# EAGLE design FuckIO_REV00 (EAGLE 9.6.1)
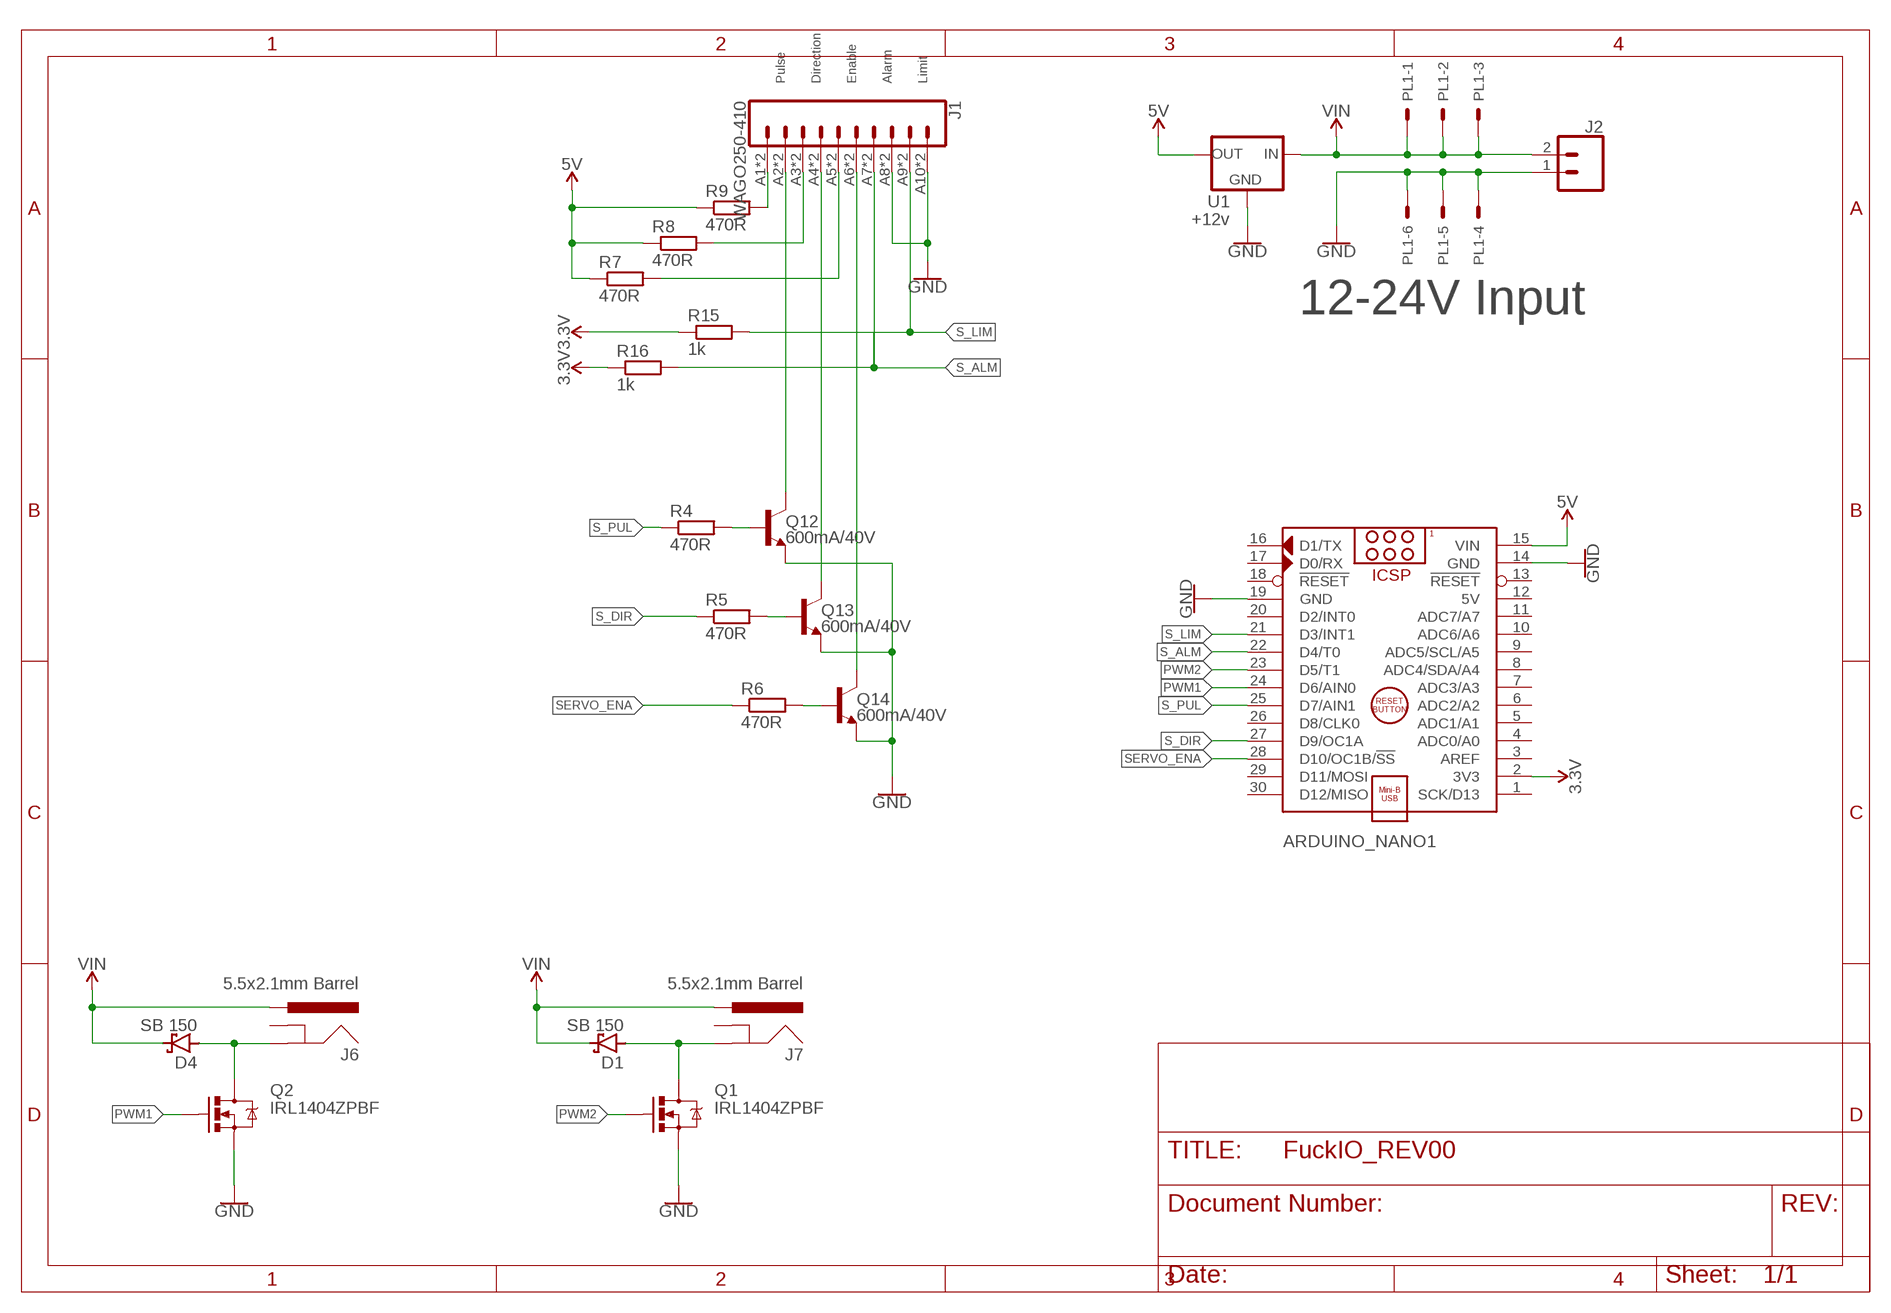
[diagram p0: schematic, sheet 1]

## Parts
ARDUINO_NANO1  ARDUINO_NANO  [ARDUINONANOV30_ARDUINO_NANO]
D1  SB 150  BAT49  [DIODE_DO41-10]
D4  SB 150  BAT49  [DIODE_DO41-10]
J1  WAGO250-410  [BEE_WAGO250-410]
J2  CONN_025MM  [SPARKFUN-CONNECTORS_SCREWTERMINAL-5MM-2]
J6  5.5x2.1mm Barrel  POWER_JACK  [SPARKFUN-CONNECTORS_POWER_JACK_PTH]
J7  5.5x2.1mm Barrel  POWER_JACK  [SPARKFUN-CONNECTORS_POWER_JACK_PTH]
PL1  CON-MOLEX-2_555X-6H  [CON-MOLEX-2_5569-6]
Q1  IRL1404ZPBF  MOSFET-NCHANNELTO220  [BEE_TO220-IGO]
Q2  IRL1404ZPBF  MOSFET-NCHANNELTO220  [BEE_TO220-IGO]
Q12  600mA/40V  TRANS_NPN-P2N2222A  [SPARKFUN-DISCRETESEMI_TO-92]
Q13  600mA/40V  TRANS_NPN-P2N2222A  [SPARKFUN-DISCRETESEMI_TO-92]
Q14  600mA/40V  TRANS_NPN-P2N2222A  [SPARKFUN-DISCRETESEMI_TO-92]
R4  470R  RCL_R-EU_0204/5  [RCL_0204/5]
R5  470R  RCL_R-EU_0204/5  [RCL_0204/5]
R6  470R  RCL_R-EU_0204/5  [RCL_0204/5]
R7  470R  RCL_R-EU_0204/5  [RCL_0204/5]
R8  470R  RCL_R-EU_0204/5  [RCL_0204/5]
R9  470R  RCL_R-EU_0204/5  [RCL_0204/5]
R15  1k  RCL_R-EU_0204/5  [RCL_0204/5]
R16  1k  RCL_R-EU_0204/5  [RCL_0204/5]
U1  +12v  V_REG_78XXSINK  [SPARKFUN-IC-POWER_TO220-IGO]

## Nets
3.3V: ARDUINO_NANO1.2(3V3) R15.1 R16.1
5V: ARDUINO_NANO1.15(VIN) R7.1 R8.1 R9.1 U1.OUT
GND: ARDUINO_NANO1.14(GND) ARDUINO_NANO1.19(GND) J1.A8 J1.A10 J1.B8 J1.B10 J2.1 PL1.4 PL1.5 PL1.6 Q1.S Q2.S Q12.3(E) Q13.3(E) Q14.3(E) U1.GND
N$2: J1.A5 J1.B5 R7.2
N$9: J1.A3 J1.B3 R8.2
N$10: J1.A1 J1.B1 R9.2
N$11: J1.A6 J1.B6 Q14.1(C)
N$12: J1.A4 J1.B4 Q13.1(C)
N$13: J1.A2 J1.B2 Q12.1(C)
N$18: Q12.2(B) R4.2
N$19: Q13.2(B) R5.2
N$20: Q14.2(B) R6.2
N$30: D4.A J6.GND Q2.D
N$35: D1.A J7.GND Q1.D
PWM1: ARDUINO_NANO1.24(D6/AIN0) Q2.G
PWM2: ARDUINO_NANO1.23(D5/T1) Q1.G
S_ALM: ARDUINO_NANO1.22(D4/T0) J1.A7 J1.B7 R16.2
S_DIR: ARDUINO_NANO1.27(D9/OC1A) R5.1
S_LIM: ARDUINO_NANO1.21(D3/INT1) J1.A9 J1.B9 R15.2
S_PUL: ARDUINO_NANO1.25(D7/AIN1) R4.1
SERVO_ENA: ARDUINO_NANO1.28(D10/OC1B/!SS) R6.1
VIN: D1.C D4.C J2.2 J6.PWR J7.PWR PL1.1 PL1.2 PL1.3 U1.IN
Unconnected: ARDUINO_NANO1.1(SCK/D13) ARDUINO_NANO1.3(AREF) ARDUINO_NANO1.4(ADC0/A0) ARDUINO_NANO1.5(ADC1/A1) ARDUINO_NANO1.6(ADC2/A2) ARDUINO_NANO1.7(ADC3/A3) ARDUINO_NANO1.8(ADC4/SDA/A4) ARDUINO_NANO1.9(ADC5/SCL/A5) ARDUINO_NANO1.10(ADC6/A6) ARDUINO_NANO1.11(ADC7/A7) ARDUINO_NANO1.13(!RESET) ARDUINO_NANO1.16(D1/TX) ARDUINO_NANO1.17(D0/RX) ARDUINO_NANO1.18(!RESET) ARDUINO_NANO1.20(D2/INT0) ARDUINO_NANO1.26(D8/CLK0) ARDUINO_NANO1.29(D11/MOSI) ARDUINO_NANO1.30(D12/MISO) J6.GNDBREAK J7.GNDBREAK

## Notes on the sheet
- Pulse | Direction | Enable | Alarm | Limit
- 12-24V Input

## Power pins joined to a net without a drawn wire
5V: ARDUINO_NANO1.12(5V)

## Library data of the parts
ARDUINO_NANO1 = FuckIO_REV00:ARDUINO_NANO: Arduino Nano V3.0 Module Overview: The Arduino Nano is a small, complete, and breadboard-friendly board based on the ATmega328 (Arduino Nano 3.x) or ATmega168 (Arduino Nano 2.x). It has more or less the same functionality of the Arduino Duemilanove, but in a different package. It lacks only a DC power jack, and works with a Mini-B USB cable instead of a standard one. The Nano was designed and is being produced by Gravitech <http://www.gravitech.us/arna30wiatp.html>. General specifications: Item Value Microcontroller Atmel ATmega168 or ATmega328 Operating Voltage (logic level) 5 V Input Voltage (recommended) 7-12 V Input Voltage (limits) 6-20 V Digital I/O Pins 14 (of which 6 provide PWM output) Analog Input Pins 8 DC Current per I/O Pin 40 mA Flash Memory 16 KB (ATmega168) or 32 KB (ATmega328) of which 2 KB used by bootloader SRAM 1 KB (ATmega168) or 2 KB (ATmega328) EEPROM 512 bytes (ATmega168) or 1 KB (ATmega328) Clock Speed 16 MHz Dimensions (Inches) 0.73" x 1.70" Dimensions (mm) 18mm x 45mm Overall height About 9 mm (not including pins) Weigth 5 g Power: The Arduino Nano can be powered via the Mini-B USB connection, 6-20V unregulated external power supply (pin 30), or 5V regulated external power supply (pin 27). The power source is automatically selected to the highest voltage source. Memory: The ATmega168 has 16 KB of flash memory for storing code (of which 2 KB is used for the bootloader); the ATmega328 has 32 KB, (also with 2 KB used for the bootloader). The ATmega168 has 1 KB of SRAM and 512 bytes of EEPROM (which can be read and written with the EEPROM library); the ATmega328 has 2 KB of SRAM and 1 KB of EEPROM. Input and Output: Each of the 14 digital pins on the Nano can be used as an input or output, using pinMode(), digitalWrite(), and digitalRead() functions. They operate at 5 volts. Each pin can provide or receive a maximum of 40 mA and has an internal pull-up resistor (disconnected by default) of 20-50 kOhms. In addition, some pins have specialized functions. Visit Arduino - ArduinoBoardNano <https://www.arduino.cc/en/Main/ArduinoBoardNano>
D1 D4 = FuckIO_REV00:BAT49: DIODE small signal diode
J1 = FuckIO_REV00:WAGO250-410
J2 = FuckIO_REV00:CONN_02: Multi connection point. Often used as Generic Header-pin footprint for 0.1 inch spaced/style header connections On any of the 0.1 inch spaced packages, you can populate with these: Break Away Headers - Straight <https://www.sparkfun.com/products/116> (PRT-00116) Break Away Male Headers - Right Angle <https://www.sparkfun.com/products/553> (PRT-00553) Female Headers <https://www.sparkfun.com/products/115> (PRT-00115) Break Away Headers - Machine Pin <https://www.sparkfun.com/products/117> (PRT-00117) Break Away Female Headers - Swiss Machine Pin <https://www.sparkfun.com/products/743> (PRT-00743) For SCREWTERMINALS and SPRING TERMINALS visit here: Screw Terimnals on SparkFun.com <https://www.sparkfun.com/search/results?term=Screw+Terminals> (5mm/3.5mm/2.54mm spacing) This device is also useful as a general connection point to wire up your design to another part of your project. Our various solder wires solder well into these plated through hole pads. Hook-Up Wire - Assortment (Stranded, 22 AWG) <https://www.sparkfun.com/products/11375> (PRT-11375) Hook-Up Wire - Assortment (Solid Core, 22 AWG) <https://www.sparkfun.com/products/11367> (PRT-11367) View the entire wire category on our website here <https://www.sparkfun.com/categories/141> Special notes: Molex polarized connector foot print use with: PRT-08233 with associated crimp pins and housings. 2.54_SCREWTERM for use with PRT-10571. 3.5mm Screw Terminal footprints for PRT-08084 5mm Screw Terminal footprints for use with PRT-08432; PROD_ID: CONN-13512; SF_ID: PRT-09918; SF_SKU: PRT-08432; SKU: PRT-09914
J6 J7 = FuckIO_REV00:POWER_JACK: Power Jack Connector This is the standard 5.5mm barrel jack for power. The PTH is the most common, proven, reliable, footprint. The Slot footprint only works if the mill layer is transmitted to the PCB fab house so be warned. Here are the connectors we sell at SparkFun: DC Barrel Power Jack/Connector <https://www.sparkfun.com/products/119> (PRT-00119) DC Barrel Power Jack/Connector (SMD) <https://www.sparkfun.com/products/12748> (PRT-12748) DC Barrel Jack Adapter - Breadboard Compatible <https://www.sparkfun.com/products/10811> (PRT-10811) It is used on this SparkFun product (and many, many others): SparkFun RedBoard - Programmed with Arduino <https://www.sparkfun.com/products/12757> (DEV-12757) Also, if you need a mating power supply or connector, please check these out: Wall Adapter Power Supply - 9VDC 650mA <https://www.sparkfun.com/products/298> (TOL-00298) DC Barrel Jack Adapter - Male <https://www.sparkfun.com/products/10287> (PRT-10287); PROD_ID: CONN-08106; SF_ID: PRT-12748
PL1 = FuckIO_REV00:CON-MOLEX-2_555X-6: Mini FIT connector 6 way
Q1 Q2 = FuckIO_REV00:MOSFET-NCHANNEL
Q12-Q14 = FuckIO_REV00:TRANS_NPN: NPN transistor Current controlled devices typically used to amplify current or used as a switch. BC547 - COM-08928 <http://www.sparkfun.com/products/8928> (TO-92 45V 100mA) (1.Collector 2.Base 3.Emitter) 2N3904 - COM-00521 <http://www.sparkfun.com/products/521> (TO-92 40V 200mA) (1.Emitter 2.Base 3.Collector) P2N2222A - COM-12852 <http://www.sparkfun.com/products/12852> (TO-92 40V 600mA) (1.Collector 2.Base 3.Emitter); PROD_ID: TRANS-09536
R4-R9 R15 R16 = FuckIO_REV00:RCL_R-EU_: RESISTOR, European symbol; SPICEPREFIX: R
U1 = FuckIO_REV00:V_REG_78XX: Voltage Regulator Standard 78xx regulator. IGO (Input Ground Output). Spark Fun Electronics SKU : COM-00107; PROD_ID: VREG-12370; SF_ID: COM-00107

## Board
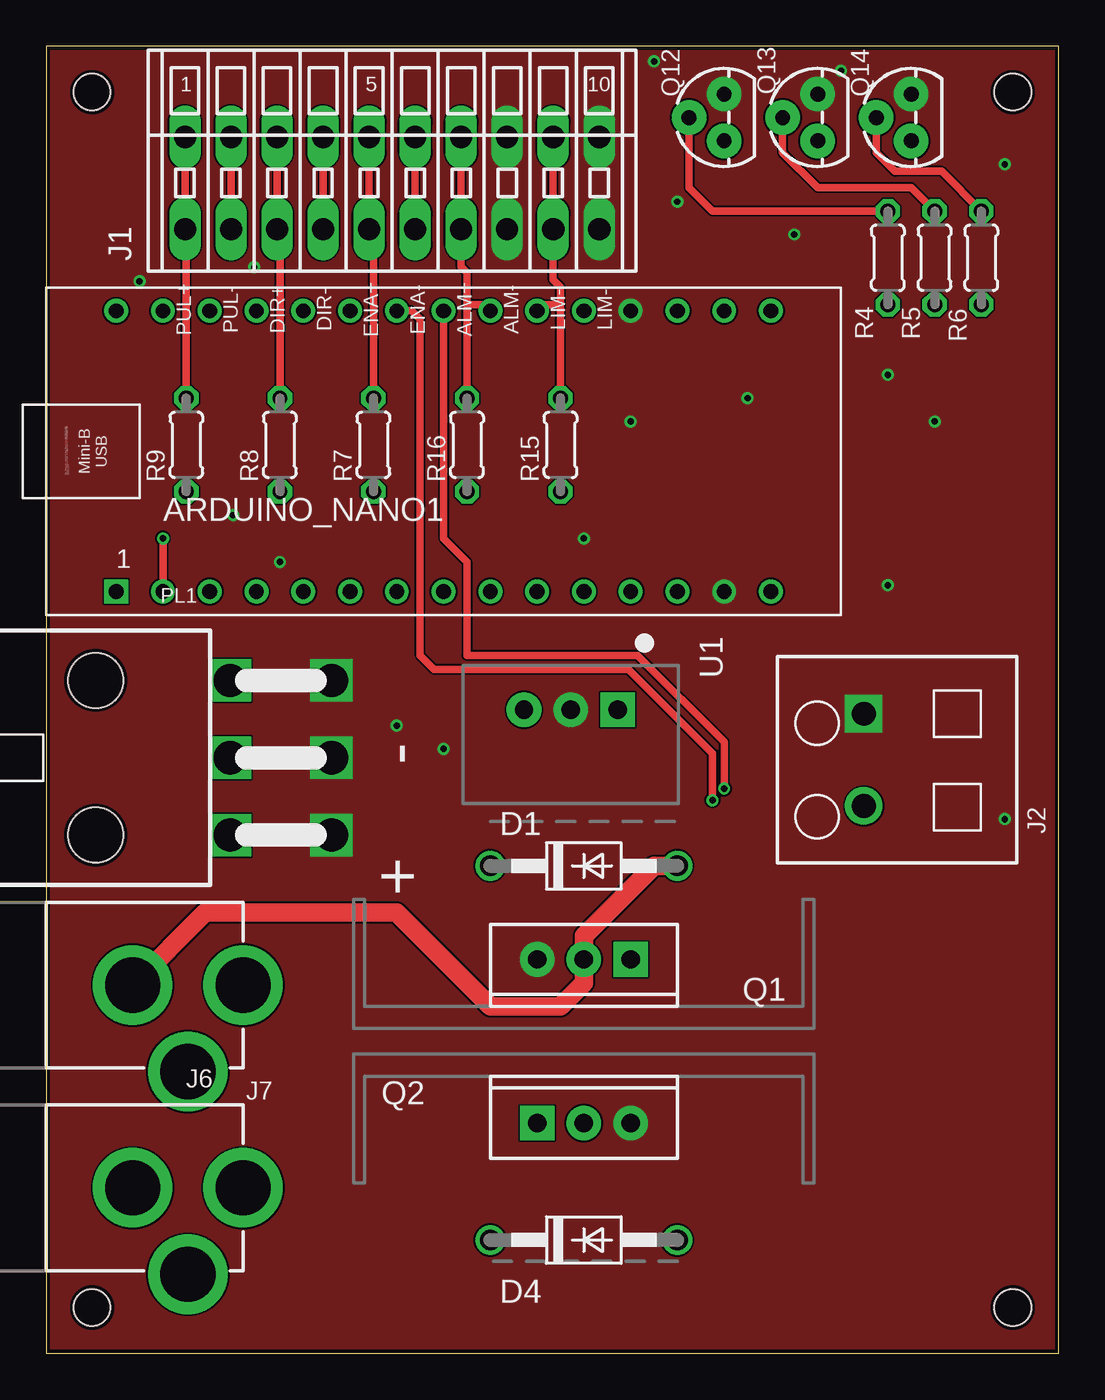
[diagram p1: board, top side]
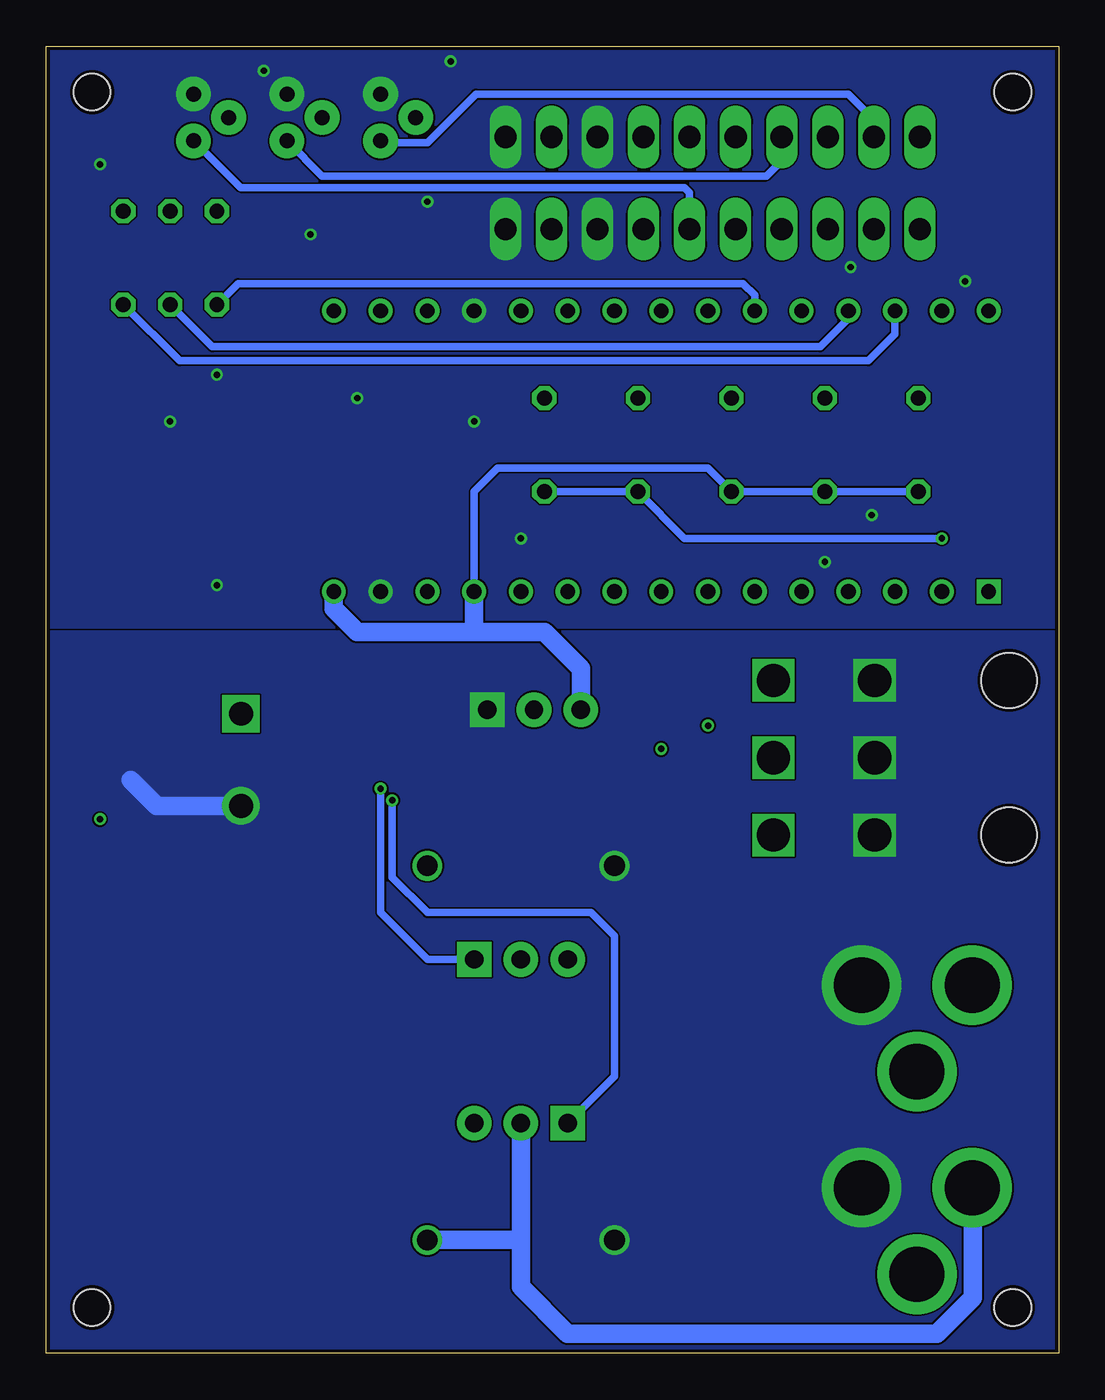
[diagram p2: board, bottom side, seen from below]

Size 55 x 71 mm. Coordinates in mm from the lower left corner, seen from the top.
Outline: 0,0 55,0 55,71 0,71 0,0
Copper layers (1*16): Top 0.035mm / dielectric 0.2mm / Bottom 0.035mm
Design rules "aisler_2_layer_blitz": minimum track width 0.1mm, minimum drill 0.2mm, track to track 0.1mm, track to pad 0.1mm, pad to pad 0.1mm, via to via 0.1mm, smd to smd 0.1mm, copper to edge 0.2mm, drill to drill 0.21mm, minimum pad ring 0.25mm, minimum via ring 0.15mm, stop-mask expansion 0mil, vias tented up to drill 0mil, thermal gap 10mil
Holes 2 mm at 2.5,68.5 52.5,68.5 2.5,2.5 52.5,2.5

### Footprints (pad centres in the part's own frame; a part is rotated, then mirrored left to right if it is on the bottom)
ARDUINONANOV30_ARDUINO_NANO = drill 0.8 square: 1 -20.32,-7.62 | drill 0.8: 2 -17.78,-7.62; 3 -15.24,-7.62; 4 -12.7,-7.62; 5 -10.16,-7.62; 6 -7.62,-7.62; 7 -5.08,-7.62; 8 -2.54,-7.62; 9 0,-7.62; 10 2.54,-7.62; 11 5.08,-7.62; 12 7.62,-7.62; 13 10.16,-7.62; 14 12.7,-7.62; 15 15.24,-7.62; 16 15.24,7.62; 17 12.7,7.62; 18 10.16,7.62; 19 7.62,7.62; 20 5.08,7.62; 21 2.54,7.62; 22 0,7.62; 23 -2.54,7.62; 24 -5.08,7.62; 25 -7.62,7.62; 26 -10.16,7.62; 27 -12.7,7.62; 28 -15.24,7.62; 29 -17.78,7.62; 30 -20.32,7.62
DIODE_DO41-10 = drill 1.118: A 5.08,0; C -5.08,0
BEE_WAGO250-410 = drill 1.2 long: A1 -11.25,2.5; A2 -8.75,2.5; A3 -6.25,2.5; A4 -3.75,2.5; A5 -1.25,2.5; A6 1.25,2.5; A7 3.75,2.5; A8 6.25,2.5; A9 8.75,2.5; A10 11.25,2.5; B1 -11.25,-2.5; B2 -8.75,-2.5; B3 -6.25,-2.5; B4 -3.75,-2.5; B5 -1.25,-2.5; B6 1.25,-2.5; B7 3.75,-2.5; B8 6.25,-2.5; B9 8.75,-2.5; B10 11.25,-2.5
SPARKFUN-CONNECTORS_SCREWTERMINAL-5MM-2 = drill 1.3 pad 2.032 square: 1 -2.54,0 | drill 1.3 pad 2.032: 2 2.46,0
SPARKFUN-CONNECTORS_POWER_JACK_PTH = drill 2.997 pad 4.318: GND 0,7.7; GNDBREAK 4.7,10.7; PWR 0,13.7
CON-MOLEX-2_5569-6 = drill 1.8 square: 1 4.2,0; 2 0,0; 3 -4.2,0; 4 4.2,5.5; 5 0,5.5; 6 -4.2,5.5 | hole 3: 4.2,-7.3; -4.2,-7.3
BEE_TO220-IGO = drill 1 pad 1.88: D 0,0; S 2.54,0 | drill 1 pad 1.88 square: G -2.54,0
SPARKFUN-DISCRETESEMI_TO-92 = drill 0.813 pad 1.88: 1 -1.27,0; 2 0,1.905; 3 1.27,0
RCL_0204/5 = drill 0.813 octagon: 1 -2.54,0; 2 2.54,0
SPARKFUN-IC-POWER_TO220-IGO = drill 1 pad 1.88: GND 0,0; OUT 2.54,0 | drill 1 pad 1.88 square: IN -2.54,0

### Placement (x,y rotation side)
ARDUINO_NANO1  24.13,49 0 top
D1  29.21,26.48 0 top
D4  29.21,6.16 0 top
J1  18.8,63.56 0 top
J2  44.41,32.2 270 top
J6  -3,9 270 top
J7  -3,20 270 top
PL1  10,32.35 270 top
Q1  29.21,21.4 180 top
Q2  29.21,12.51 0 top
Q12  36.83,67.12 90 top
Q13  41.91,67.12 90 top
Q14  46.99,67.12 90 top
R4  45.72,59.5 90 top
R5  48.26,59.5 90 top
R6  50.8,59.5 90 top
R7  17.78,49.34 90 top
R8  12.7,49.34 90 top
R9  7.62,49.34 90 top
R15  27.94,49.34 90 top
R16  22.86,49.34 90 top
U1  28.5,34.96 180 top

### Tracks (layer width: path | path; a pad name or v marks a point on that pad's centre or on a via)
3.3V  (via drill 0.35)
  Top 0.406: ARDUINO_NANO1.2 v6.35,44.26
  Bottom 0.406: R15.1 R16.1 20.32,44.26 v6.35,44.26
5V
  Bottom 0.406: R9.1 R8.1 R7.1 19.05,48.07 30.48,48.07 31.75,46.8 ARDUINO_NANO1.12
  Bottom 1.016: U1.OUT 25.96,37.2 27.94,39.18 31.75,39.18 | 31.75,39.18 38.1,39.18 39.37,40.45 ARDUINO_NANO1.15 | ARDUINO_NANO1.12 31.75,39.18
GND  (via drill 0.35)
  other vias: 19.05,34.1 21.59,32.83 29.21,44.26 12.7,42.99 10.16,45.53 45.72,53.15 48.26,50.61 45.72,41.72 34.29,62.55 40.64,60.77 52.07,64.58 31.75,50.61 11.3,58.99 5.08,58.23 52.07,29.02 43.18,69.66 33.02,70.17 38.1,51.88
  pour Top (rank 6, no thermals): 0,-0.19 0,72.2 57.15,72.2 57.15,-0.19
  pour Bottom (rank 6, no thermals): 0,39.18 57.15,39.18 57.15,70.93 0,70.93
N$2
  Top 0.406: J1.A5 J1.B5 17.78,60.83 R7.2
N$9
  Top 0.406: J1.A3 J1.B3 12.7,60.91 R8.2
N$10
  Top 0.406: J1.A1 J1.B1 7.62,60.99 R9.2
N$11
  Top 0.406: J1.B6 J1.A6
  Bottom 0.406: Q14.1 46.97,65.85 44.43,63.31 20.32,63.31 20.05,63.04 J1.B6
N$12
  Top 0.406: J1.A4 J1.B4
  Bottom 0.406: J1.A4 15.05,64.77 15.88,63.94 40,63.94 Q13.1
N$13
  Top 0.406: J1.A2 J1.B2
  Bottom 0.406: Q12.1 36.73,65.75 34.29,65.75 31.65,68.39 11.43,68.39 10.05,67.01 J1.A2
N$18
  Top 0.406: R4.2 36.2,62.04 34.92,63.31 Q12.2
N$19
  Top 0.406: R5.2 46.99,63.31 41.91,63.31 40.01,65.22 Q13.2
N$20
  Top 0.406: R6.2 48.64,64.2 46.1,64.2 45.09,65.22 Q14.2
N$30
  Bottom 1.016: J6.GND 4.68,8.98 4.68,3.03 6.63,1.08 26.67,1.08 29.21,3.62 29.21,6.16 | 29.21,6.16 Q2.D | D4.A 29.21,6.16
N$35
  Top 1.016: J7.GND 8.64,23.94 19.05,23.94 24.13,18.86 27.94,18.86 29.21,20.13 Q1.D 29.21,22.67 33.02,26.48 D1.A
PWM1  (via drill 0.35)
  Top 0.406: v36.2,30.04 36.2,32.58 31.62,37.15 21.08,37.15 20.32,37.91 20.32,56.16 19.86,56.62 ARDUINO_NANO1.24
  Bottom 0.406: Q2.G 24.13,15.05 24.13,22.67 25.4,23.94 34.29,23.94 36.2,25.84 v36.2,30.04
PWM2  (via drill 0.35)
  Top 0.406: ARDUINO_NANO1.23 21.59,44.26 22.86,42.99 22.86,37.91 32.13,37.91 36.83,33.21 v36.83,30.67
  Bottom 0.406: v36.83,30.67 36.83,23.94 34.29,21.4 Q1.G
S_ALM
  Top 0.406: R16.2 22.86,56.96 | J1.A7 J1.B7 22.55,59.01 22.86,58.7 22.86,56.96 | ARDUINO_NANO1.22 23.79,56.96 22.86,56.96
S_DIR
  Bottom 0.406: R5.1 45.97,54.67 12.95,54.67 11.43,56.2 ARDUINO_NANO1.27
S_LIM
  Top 0.406: R15.2 27.94,56.96 | J1.A9 J1.B9 27.55,58.31 27.94,57.91 27.94,56.96 | ARDUINO_NANO1.21 27.01,56.96 27.94,56.96
S_PUL
  Bottom 0.406: R4.1 44.58,58.1 17.14,58.1 16.51,57.47 ARDUINO_NANO1.25
SERVO_ENA
  Bottom 0.406: ARDUINO_NANO1.28 8.89,55.35 10.33,53.91 47.75,53.91 R6.1
VIN
  Bottom 1.016: J2.2 48.98,29.74 50.39,31.15
  pour Bottom (no thermals): 0,-0.19 57.15,-0.19 57.15,39.18 0,39.18

### Text on the board
tPlace: PUL+ | PUL- | DIR+ | DIR- | ENA+ | ENA- | ALM+ | ALM- | LIM- | LIM- | + -